# Altium schematic sheet MED_BOX.SchDoc
size A4; SheetNumber: 1; SheetTotal: 6
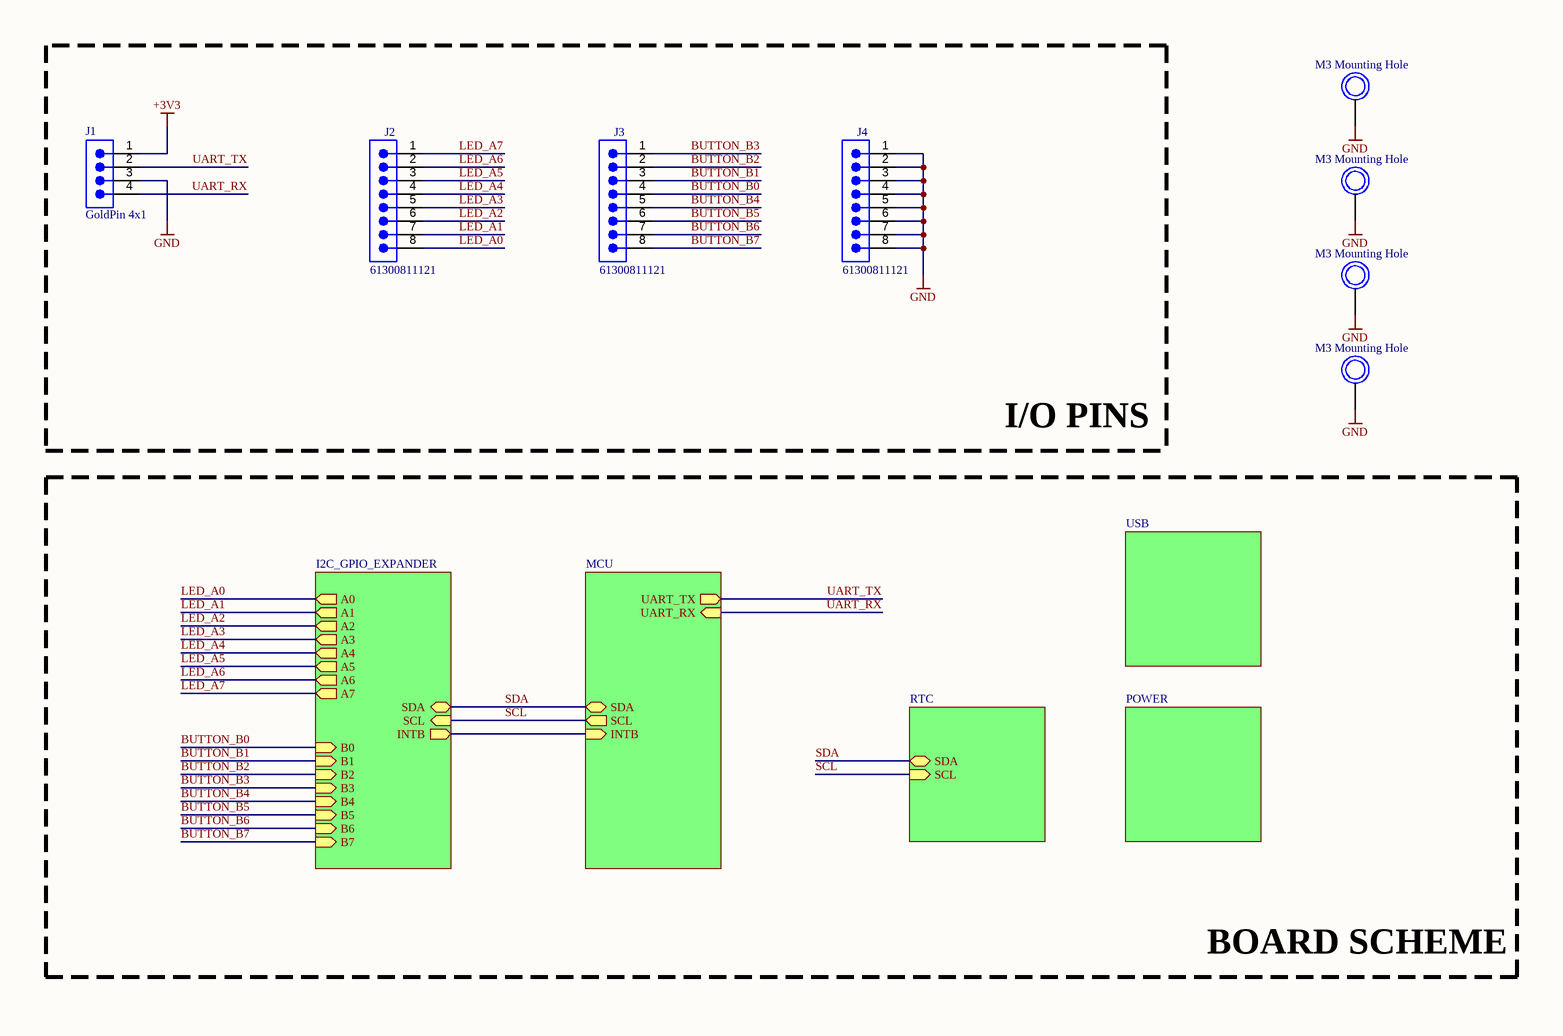
[diagram p0: MED_BOX.SchDoc]

## Parts
J1  GoldPin 4x1  [SMTC-TSW-104-08-X-S]
J2  61300811121  [61300811121]
J3  61300811121  [61300811121]
J4  61300811121  [61300811121]
MH1  M3 Mounting Hole  [Copy of M4 Mounting Hole]
MH2  M3 Mounting Hole  [Copy of M4 Mounting Hole]
MH3  M3 Mounting Hole  [Copy of M4 Mounting Hole]
MH4  M3 Mounting Hole  [Copy of M4 Mounting Hole]

## Blocks framed on the sheet
I/O PINS: J1-J4

## Sub-sheets
Designator = MCU: SDA (bidir), SCL (out), INTB (in), UART_TX (out), UART_RX (in)
Designator = I2C_GPIO_EXPANDER: A0 (out), A1 (out), A2 (out), A3 (out), A4 (out), A5 (out), A6 (out), A7 (out), B0 (in), B1 (in), B2 (in), B3 (in), B4 (in), B5 (in), B6 (in), B7 (in), SCL (in), SDA (bidir), INTB (out)
Designator = POWER: no entries
RTC = RTC: SDA (bidir), SCL (in)
USB = USB: no entries

## Nets
+3V3: J1.1
GND: J1.3 J4.1 J4.2 J4.3 J4.4 J4.5 J4.6 J4.7 J4.8 MH1.1 MH2.1 MH3.1 MH4.1
BUTTON_B0: J3.4 ; sheet Designator/B0
BUTTON_B1: J3.3 ; sheet Designator/B1
BUTTON_B2: J3.2 ; sheet Designator/B2
BUTTON_B3: J3.1 ; sheet Designator/B3
BUTTON_B4: J3.5 ; sheet Designator/B4
BUTTON_B5: J3.6 ; sheet Designator/B5
BUTTON_B6: J3.7 ; sheet Designator/B6
BUTTON_B7: J3.8 ; sheet Designator/B7
LED_A0: J2.8 ; sheet Designator/A0
LED_A1: J2.7 ; sheet Designator/A1
LED_A2: J2.6 ; sheet Designator/A2
LED_A3: J2.5 ; sheet Designator/A3
LED_A4: J2.4 ; sheet Designator/A4
LED_A5: J2.3 ; sheet Designator/A5
LED_A6: J2.2 ; sheet Designator/A6
LED_A7: J2.1 ; sheet Designator/A7
SCL: sheet Designator/SCL, sheet Designator/SCL, sheet RTC/SCL
SDA: sheet Designator/SDA, sheet Designator/SDA, sheet RTC/SDA
UART_RX: J1.4 ; sheet Designator/UART_RX
UART_TX: J1.2 ; sheet Designator/UART_TX
(unnamed): sheet Designator/INTB, sheet Designator/INTB

## Notes on the sheet
- BOARD SCHEME
- DWG. NO.
- REV.
- SHT.
- REVISION
- DESCRIPTION
- DATE
- APPROVED
- THIS DOCUMENT AND THE DATA DISCLOSED HEREIN OR HEREWITH IS THE PROPERTY OF ALTIUM LIMITED AND MAY BE FREELY DISTRIBUTED IN WHOLE. NO RIGHTS ARE RESERVED OR EXPRESS OR IMPLIED WARANTEE GIVEN.
- ENG:
- DSN:
- APPROVALS
- PROJECT
- DOCUMENT REVISION:
- DESIGN ITEM:
- CHK:
- BOM:
- REFERENCE DOCUMENTS
- PROJECT REVISION:
- TITLE
- FAB DWG:
- PCB DWG:
- ASSY DWG:
- SCALE:
- SIZE
- D
- CAGE CODE
- FILE NAME
- DWG NO.
- SHEET
- OF
- REV

## Library data of the parts
J1 = CMP-00067-4: TSW - Samtec 2.54mm Pin Header 13.46mm Overall Pin Length 5.08mm Tail (08) (mcv)(TO22); Manufacturer: Molex
J2-J4 = CMP-1502-01076-4: THT Vertical Pin Header WR-PHD, Pitch 2.54 mm, Single Row, 8 pins; Pitch: 2.54mm; Voltage Rating: 250V; Connector Type: Male Pin; Current Rating: 3A; Contact Resistance: 20mΩ; Number of Positions: 8; Gender: Male; Contact Mating Length: 5.9944mm; Orientation: Vertical; Contact Plating: Gold; Mount: Through Hole; Min Operating Temperature: -40°C; Packaging: Bulk; Height: 8.54mm; Number of Pins: 8; Contact Material: Gold; Operating Supply Voltage: 250V; Termination: Solder; RoHS: Compliant; Color: Black; Number of Contacts: 8; Lead Pitch: 2.54mm; Number of Rows: 1; Max Operating Temperature: 105°C
MH1-MH4 = CONN-00002-1: Manufacturer: Molex